# Altium schematic sheet Cover.SchDoc
size A4; File Name: Block Diagram.SchDoc; Project: FirstProject; ENG_APP_DATE: --/--/--; DSN_APP_DATE: --/--/--; CHK_APP_DATE: --/--/--; Date: 06/11/2023; Engineer: Mustafa Oguz ATES; DocumentNumber: 1; SheetNumber: 1; SheetTotal: 5; Prepared By: Mustafa Oguz ATES; Time: 14.05
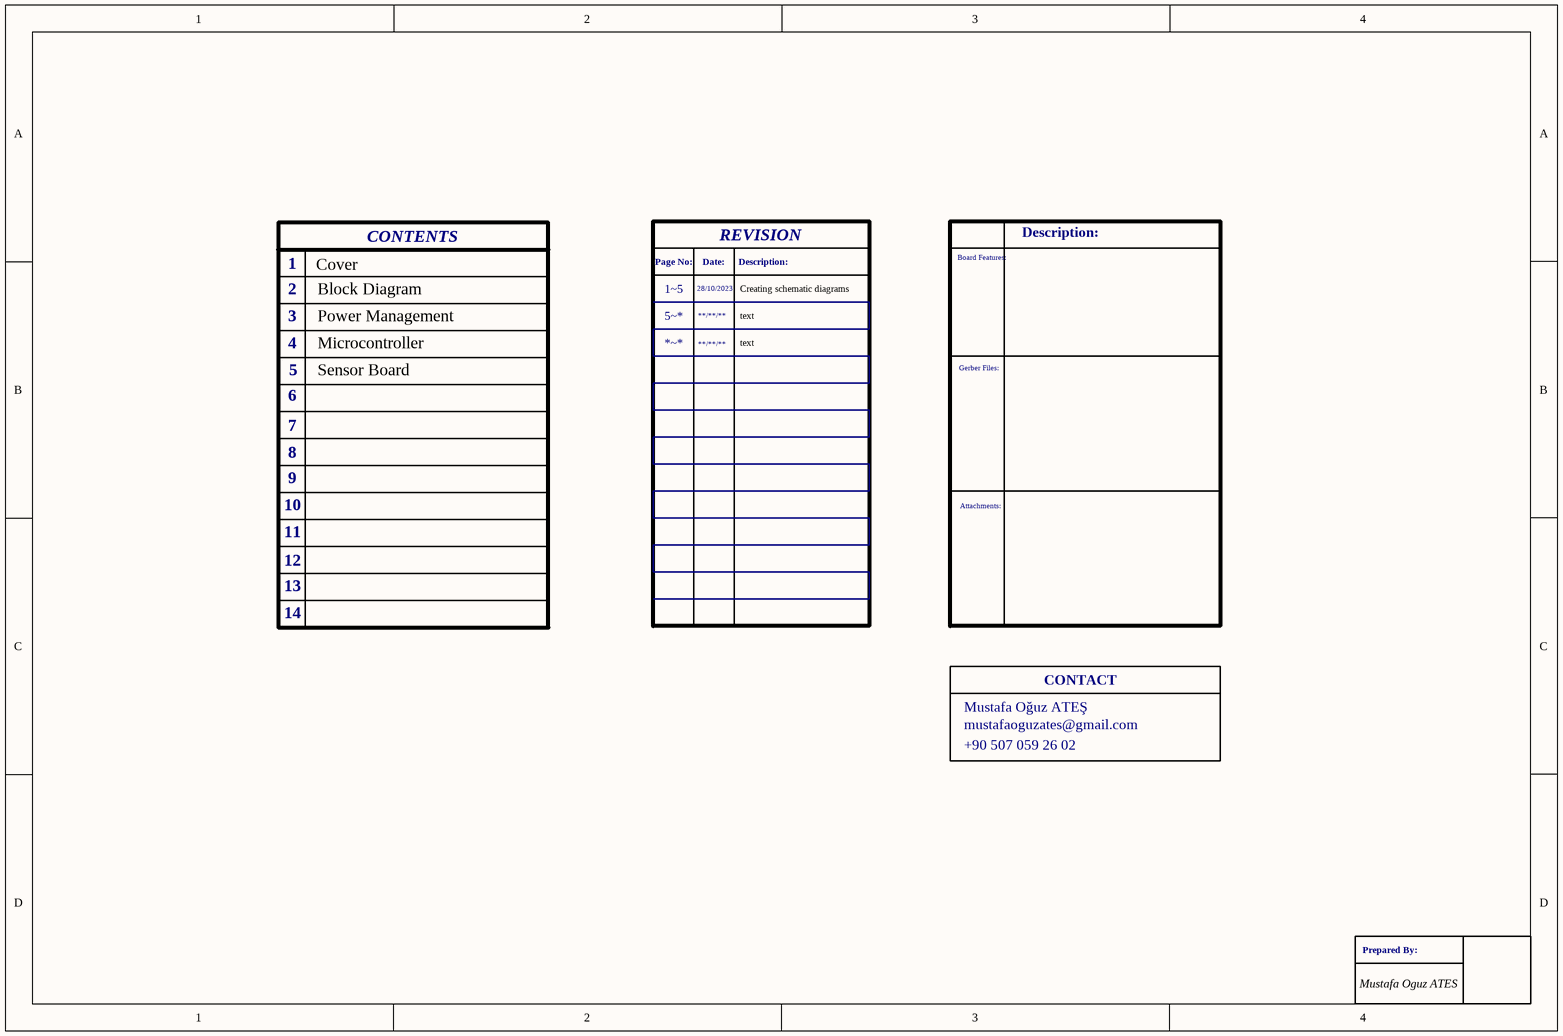
[diagram p0: Cover.SchDoc]

## Notes on the sheet
- CONTENTS
- REVISION
- Description:
- 1
- 2
- Cover
- Block Diagram
- Page No:
- 1~5
- 28/10/2023
- **/**/**
- Date:
- Creating schematic diagrams
- Board Features:
- 3
- 4
- 5
- Power Management
- Microcontroller
- Sensor Board
- 5~*
- *~*
- text
- Gerber Files:
- 6
- 7
- 10
- 8
- 9
- Attachments:
- 11
- 12
- 13
- 14
- Mustafa Oğuz ATEŞ
- CONTACT
- mustafaoguzates@gmail.com
- +90 507 059 26 02
- Text
- Prepared By:
- Engineer: